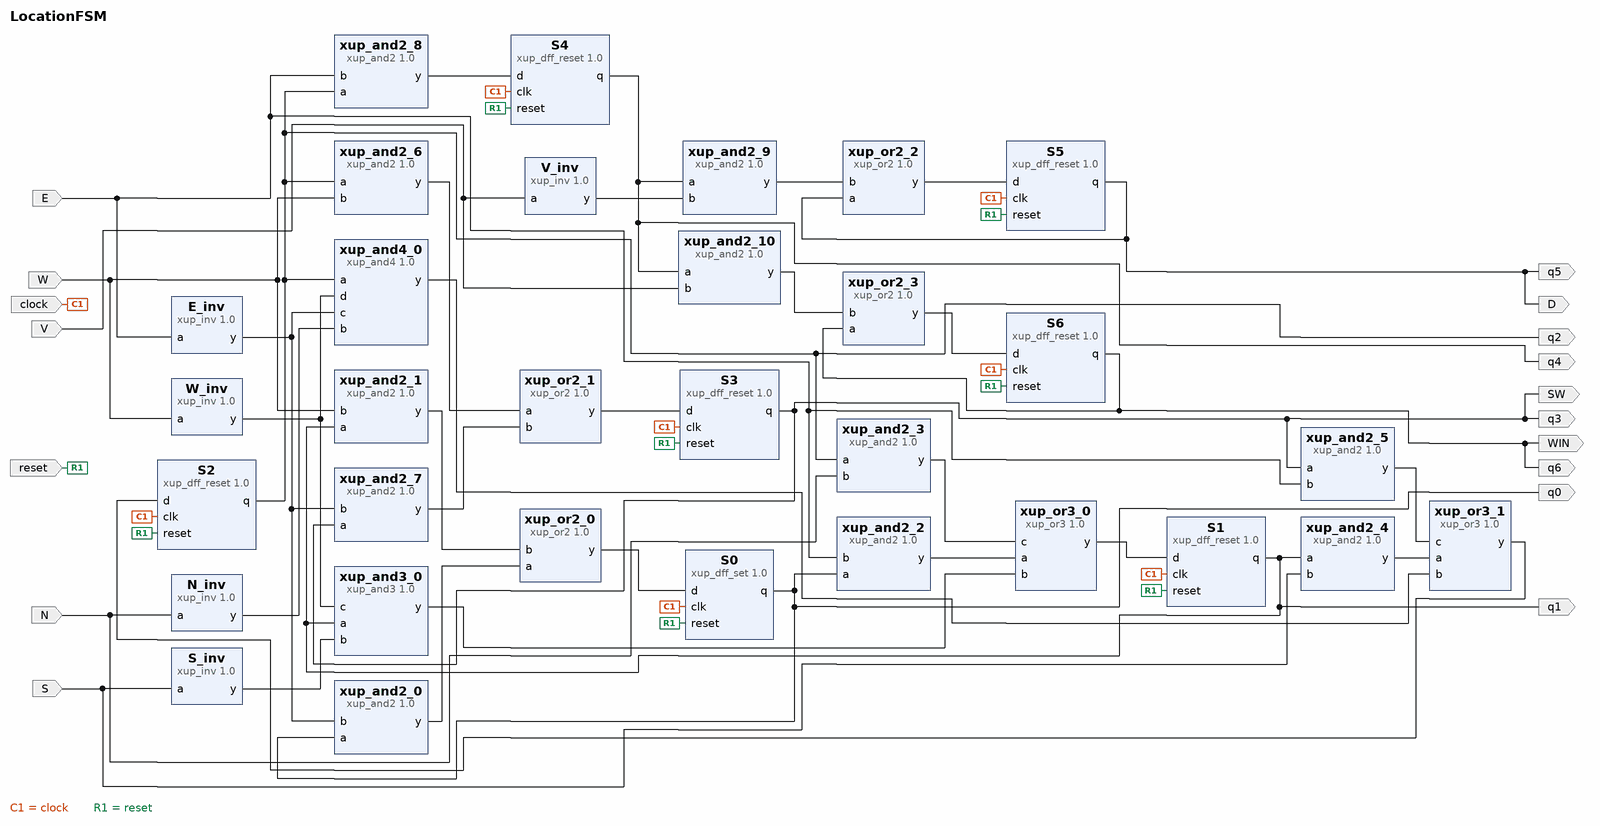
[diagram p0: block diagram of the top level]
# Vivado block design LocationFSM, xc7a100tcsg324-1, Vivado 2019.2
create_bd_design LocationFSM

create_bd_port -dir I N
create_bd_port -dir I S
create_bd_port -dir I E
create_bd_port -dir I W
create_bd_port -dir I V
create_bd_port -dir I clock
create_bd_port -dir I reset
create_bd_port -dir O q5
create_bd_port -dir O q4
create_bd_port -dir O q3
create_bd_port -dir O q2
create_bd_port -dir O q1
create_bd_port -dir O q0
create_bd_port -dir O q6
create_bd_port -dir O D
create_bd_port -dir O SW
create_bd_port -dir O WIN

create_bd_cell -type ip -vlnv xilinx.com:user:xup_dff_set:1.0 S0
create_bd_cell -type ip -vlnv xilinx.com:user:xup_dff_reset:1.0 S1
create_bd_cell -type ip -vlnv xilinx.com:user:xup_dff_reset:1.0 S2
create_bd_cell -type ip -vlnv xilinx.com:user:xup_dff_reset:1.0 S3
create_bd_cell -type ip -vlnv xilinx.com:user:xup_dff_reset:1.0 S4
create_bd_cell -type ip -vlnv xilinx.com:user:xup_dff_reset:1.0 S5
create_bd_cell -type ip -vlnv xilinx.com:user:xup_dff_reset:1.0 S6
create_bd_cell -type ip -vlnv xilinx.com:xup:xup_inv:1.0 N_inv
create_bd_cell -type ip -vlnv xilinx.com:xup:xup_inv:1.0 S_inv
create_bd_cell -type ip -vlnv xilinx.com:xup:xup_inv:1.0 E_inv
create_bd_cell -type ip -vlnv xilinx.com:xup:xup_inv:1.0 W_inv
create_bd_cell -type ip -vlnv xilinx.com:xup:xup_inv:1.0 V_inv
create_bd_cell -type ip -vlnv xilinx.com:xup:xup_and2:1.0 xup_and2_0
create_bd_cell -type ip -vlnv xilinx.com:xup:xup_or2:1.0 xup_or2_0
create_bd_cell -type ip -vlnv xilinx.com:xup:xup_and2:1.0 xup_and2_1
create_bd_cell -type ip -vlnv xilinx.com:xup:xup_and2:1.0 xup_and2_2
create_bd_cell -type ip -vlnv xilinx.com:xup:xup_and2:1.0 xup_and2_3
create_bd_cell -type ip -vlnv xilinx.com:xup:xup_or3:1.0 xup_or3_0
create_bd_cell -type ip -vlnv xilinx.com:xup:xup_and3:1.0 xup_and3_0
create_bd_cell -type ip -vlnv xilinx.com:xup:xup_and2:1.0 xup_and2_4
create_bd_cell -type ip -vlnv xilinx.com:xup:xup_and4:1.0 xup_and4_0
create_bd_cell -type ip -vlnv xilinx.com:xup:xup_and2:1.0 xup_and2_5
create_bd_cell -type ip -vlnv xilinx.com:xup:xup_or3:1.0 xup_or3_1
create_bd_cell -type ip -vlnv xilinx.com:xup:xup_and2:1.0 xup_and2_6
create_bd_cell -type ip -vlnv xilinx.com:xup:xup_and2:1.0 xup_and2_7
create_bd_cell -type ip -vlnv xilinx.com:xup:xup_or2:1.0 xup_or2_1
create_bd_cell -type ip -vlnv xilinx.com:xup:xup_and2:1.0 xup_and2_8
create_bd_cell -type ip -vlnv xilinx.com:xup:xup_and2:1.0 xup_and2_9
create_bd_cell -type ip -vlnv xilinx.com:xup:xup_or2:1.0 xup_or2_2
create_bd_cell -type ip -vlnv xilinx.com:xup:xup_and2:1.0 xup_and2_10
create_bd_cell -type ip -vlnv xilinx.com:xup:xup_or2:1.0 xup_or2_3

# ---- connections ----

connect_bd_net [get_bd_ports N] [get_bd_pins N_inv/a] [get_bd_pins xup_and2_3/b]
connect_bd_net [get_bd_ports S] [get_bd_pins S_inv/a] [get_bd_pins xup_and2_4/b]
connect_bd_net [get_bd_ports E] [get_bd_pins E_inv/a] [get_bd_pins xup_and2_2/b] [get_bd_pins xup_and2_5/b] [get_bd_pins xup_and2_8/b]
connect_bd_net [get_bd_ports V] [get_bd_pins V_inv/a] [get_bd_pins xup_and2_10/b]
connect_bd_net [get_bd_pins E_inv/y] [get_bd_pins xup_and2_0/b] [get_bd_pins xup_and4_0/c] [get_bd_pins xup_and2_7/b]
connect_bd_net [get_bd_ports clock] \
  [get_bd_pins S0/clk] [get_bd_pins S1/clk] [get_bd_pins S2/clk] [get_bd_pins S3/clk] [get_bd_pins S4/clk] \
  [get_bd_pins S5/clk] [get_bd_pins S6/clk]
connect_bd_net [get_bd_ports reset] \
  [get_bd_pins S6/reset] [get_bd_pins S5/reset] [get_bd_pins S4/reset] [get_bd_pins S3/reset] [get_bd_pins S2/reset] \
  [get_bd_pins S1/reset] [get_bd_pins S0/reset]
connect_bd_net -net Q5_q [get_bd_pins S5/q] [get_bd_ports q5] [get_bd_pins xup_or2_2/a] [get_bd_ports D]
connect_bd_net -net Q4_q [get_bd_pins S4/q] [get_bd_ports q4] [get_bd_pins xup_and2_9/a] [get_bd_pins xup_and2_10/a]
connect_bd_net -net Q3_q [get_bd_pins S3/q] [get_bd_ports q3] [get_bd_pins xup_and2_5/a] [get_bd_pins xup_and2_7/a] [get_bd_ports SW]
connect_bd_net -net Q2_q [get_bd_pins S2/q] \
  [get_bd_ports q2] [get_bd_pins xup_and2_3/a] [get_bd_pins xup_and4_0/a] [get_bd_pins xup_and2_6/a] \
  [get_bd_pins xup_and2_8/a]
connect_bd_net -net Q1_q [get_bd_pins S1/q] [get_bd_ports q1] [get_bd_pins xup_and2_1/a] [get_bd_pins xup_and3_0/a] [get_bd_pins xup_and2_4/a]
connect_bd_net -net Q0_q [get_bd_pins S0/q] [get_bd_ports q0] [get_bd_pins xup_and2_0/a] [get_bd_pins xup_and2_2/a]
connect_bd_net -net Q6_q [get_bd_pins S6/q] [get_bd_ports q6] [get_bd_pins xup_or2_3/a] [get_bd_ports WIN]
connect_bd_net [get_bd_ports W] [get_bd_pins W_inv/a] [get_bd_pins xup_and2_1/b] [get_bd_pins xup_and2_6/b]
connect_bd_net [get_bd_pins xup_and2_0/y] [get_bd_pins xup_or2_0/a]
connect_bd_net [get_bd_pins xup_and2_1/y] [get_bd_pins xup_or2_0/b]
connect_bd_net [get_bd_pins xup_or2_0/y] [get_bd_pins S0/d]
connect_bd_net [get_bd_pins xup_and2_2/y] [get_bd_pins xup_or3_0/a]
connect_bd_net [get_bd_pins xup_or3_0/y] [get_bd_pins S1/d]
connect_bd_net [get_bd_pins xup_and3_0/y] [get_bd_pins xup_or3_0/b]
connect_bd_net [get_bd_pins xup_and2_3/y] [get_bd_pins xup_or3_0/c]
connect_bd_net [get_bd_pins S_inv/y] [get_bd_pins xup_and3_0/b]
connect_bd_net [get_bd_pins W_inv/y] [get_bd_pins xup_and3_0/c] [get_bd_pins xup_and4_0/d]
connect_bd_net [get_bd_pins N_inv/y] [get_bd_pins xup_and4_0/b]
connect_bd_net [get_bd_pins xup_and2_4/y] [get_bd_pins xup_or3_1/a]
connect_bd_net [get_bd_pins xup_and4_0/y] [get_bd_pins xup_or3_1/b]
connect_bd_net [get_bd_pins xup_and2_5/y] [get_bd_pins xup_or3_1/c]
connect_bd_net [get_bd_pins xup_or3_1/y] [get_bd_pins S2/d]
connect_bd_net [get_bd_pins xup_and2_6/y] [get_bd_pins xup_or2_1/a]
connect_bd_net [get_bd_pins xup_and2_7/y] [get_bd_pins xup_or2_1/b]
connect_bd_net [get_bd_pins xup_or2_1/y] [get_bd_pins S3/d]
connect_bd_net [get_bd_pins xup_and2_8/y] [get_bd_pins S4/d]
connect_bd_net [get_bd_pins V_inv/y] [get_bd_pins xup_and2_9/b]
connect_bd_net [get_bd_pins xup_and2_9/y] [get_bd_pins xup_or2_2/b]
connect_bd_net [get_bd_pins xup_or2_2/y] [get_bd_pins S5/d]
connect_bd_net [get_bd_pins xup_and2_10/y] [get_bd_pins xup_or2_3/b]
connect_bd_net [get_bd_pins xup_or2_3/y] [get_bd_pins S6/d]

validate_bd_design
save_bd_design
